# Altium schematic sheet PAGE06 FPGA Power.SchDoc
size 246 x 182 mm; SheetNumber: 6; SheetTotal: 9
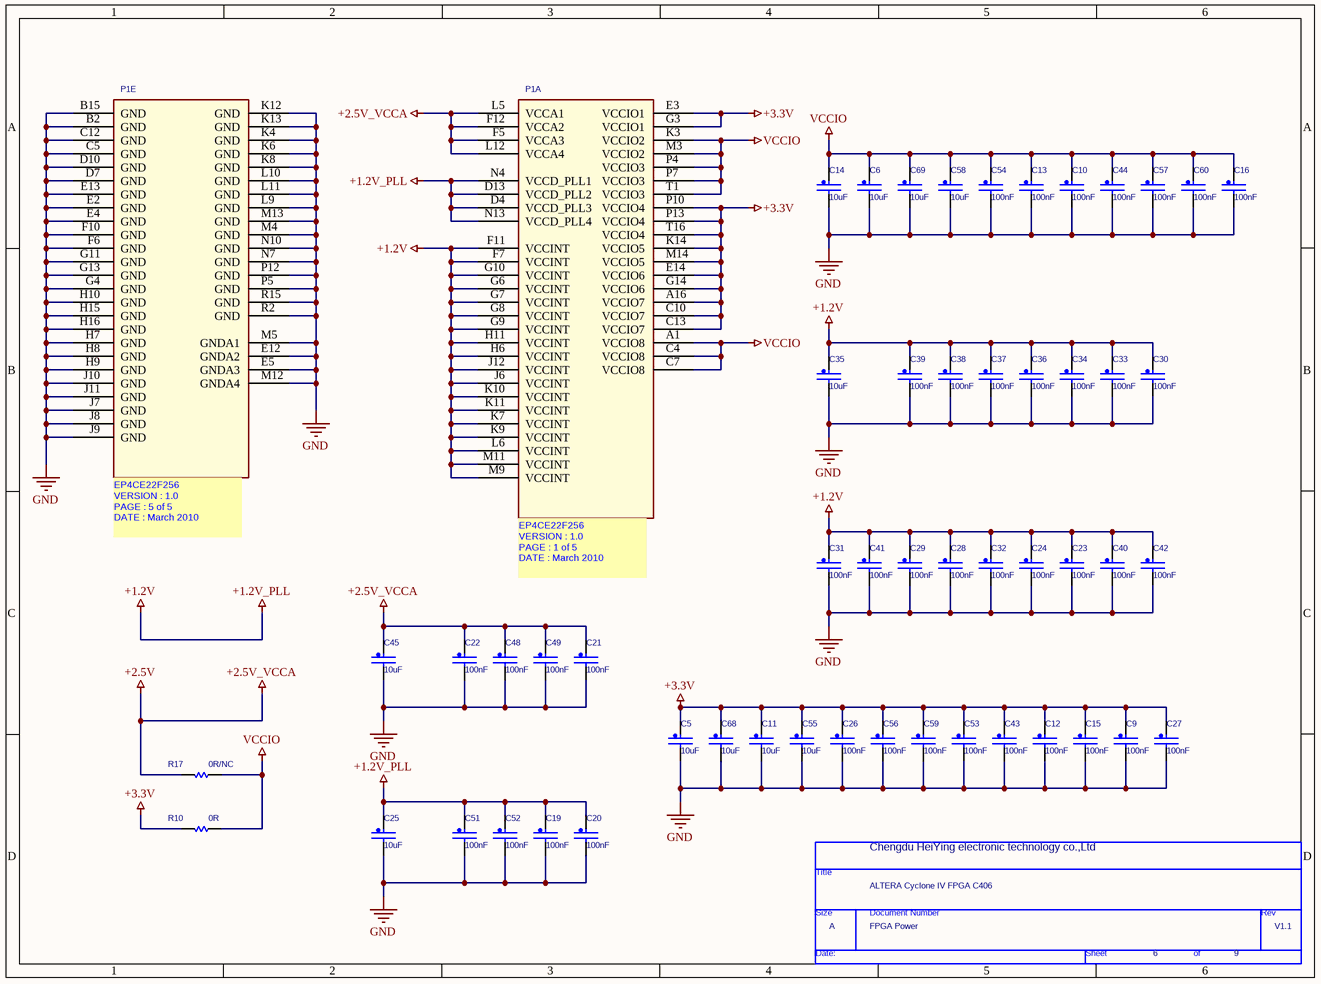
[diagram p0: PAGE06 FPGA Power.SchDoc]

## Parts
*  Page Count: 9  Page Number: 6  Page Size: A  Title: ALTERA Cyclone IV FPGA C406  RevCode: V1.1  Doc: FPGA Power  (hidden comment: TitleBlock0)  (graphical)
C5  10uF  [C0805]
C6  10uF  [C0805]
C9  100nF  [C0402]
C10  100nF  [C0402]
C11  10uF  [C0805]
C12  100nF  [C0402]
C13  100nF  [C0402]
C14  10uF  [C0805]
C15  100nF  [C0402]
C16  100nF  [C0402]
C19  100nF  [C0402]
C20  100nF  [C0402]
C21  100nF  [C0402]
C22  100nF  [C0402]
C23  100nF  [C0402]
C24  100nF  [C0402]
C25  10uF  [C0805]
C26  100nF  [C0402]
C27  100nF  [C0402]
C28  100nF  [C0402]
C29  100nF  [C0402]
C30  100nF  [C0402]
C31  100nF  [C0402]
C32  100nF  [C0402]
C33  100nF  [C0402]
C34  100nF  [C0402]
C35  10uF  [C0805]
C36  100nF  [C0402]
C37  100nF  [C0402]
C38  100nF  [C0402]
C39  100nF  [C0402]
C40  100nF  [C0402]
C41  100nF  [C0402]
C42  100nF  [C0402]
C43  100nF  [C0402]
C44  100nF  [C0402]
C45  10uF  [C0805]
C48  100nF  [C0402]
C49  100nF  [C0402]
C51  100nF  [C0402]
C52  100nF  [C0402]
C53  100nF  [C0402]
C54  100nF  [C0402]
C55  10uF  [C0805]
C56  100nF  [C0402]
C57  100nF  [C0402]
C58  10uF  [C0805]
C59  100nF  [C0402]
C60  100nF  [C0402]
C68  10uF  [C0805]
C69  10uF  [C0805]
P1  EP4CE22F256  [fbga256_opt1]  (value not drawn)  (parts A,E of 5)
R10  0R  [R0402]
R17  0R/NC  [R0402]

## Nets
+1.2V: C19.1 C20.1 C23.1 C24.1 C25.1 C28.1 C29.1 C30.1 C31.1 C32.1 C33.1 C34.1 C35.1 C36.1 C37.1 C38.1 C39.1 C40.1 C41.1 C42.1 C51.1 C52.1 P1.D4(VCCD_PLL3) P1.D13(VCCD_PLL2) P1.F7(VCCINT) P1.F11(VCCINT) P1.G6(VCCINT) P1.G7(VCCINT) P1.G8(VCCINT) P1.G9(VCCINT) P1.G10(VCCINT) P1.H6(VCCINT) P1.H11(VCCINT) P1.J6(VCCINT) P1.J12(VCCINT) P1.K7(VCCINT) P1.K9(VCCINT) P1.K10(VCCINT) P1.K11(VCCINT) P1.L6(VCCINT) P1.M9(VCCINT) P1.M11(VCCINT) P1.N4(VCCD_PLL1) P1.N13(VCCD_PLL4)  [also labelled +1.2V_PLL]
+2.5V: C21.1 C22.1 C45.1 C48.1 C49.1 P1.F5(VCCA3) P1.F12(VCCA2) P1.L5(VCCA1) P1.L12(VCCA4) R17.2  [also labelled +2.5V_VCCA]
+3.3V: C5.1 C9.1 C11.1 C12.1 C15.1 C26.1 C27.1 C43.1 C53.1 C55.1 C56.1 C59.1 C68.1 P1.A16(VCCIO7) P1.C10(VCCIO7) P1.C13(VCCIO7) P1.E3(VCCIO1) P1.E14(VCCIO6) P1.G3(VCCIO1) P1.G14(VCCIO6) P1.K14(VCCIO5) P1.M14(VCCIO5) P1.P10(VCCIO4) P1.P13(VCCIO4) P1.T16(VCCIO4) R10.2
GND: C5.2 C6.2 C9.2 C10.2 C11.2 C12.2 C13.2 C14.2 C15.2 C16.2 C19.2 C20.2 C21.2 C22.2 C23.2 C24.2 C25.2 C26.2 C27.2 C28.2 C29.2 C30.2 C31.2 C32.2 C33.2 C34.2 C35.2 C36.2 C37.2 C38.2 C39.2 C40.2 C41.2 C42.2 C43.2 C44.2 C45.2 C48.2 C49.2 C51.2 C52.2 C53.2 C54.2 C55.2 C56.2 C57.2 C58.2 C59.2 C60.2 C68.2 C69.2 P1.B2(GND) P1.B15(GND) P1.C5(GND) P1.C12(GND) P1.D7(GND) P1.D10(GND) P1.E2(GND) P1.E4(GND) P1.E5(GNDA3) P1.E12(GNDA2) P1.E13(GND) P1.F6(GND) P1.F10(GND) P1.G4(GND) P1.G11(GND) P1.G13(GND) P1.H7(GND) P1.H8(GND) P1.H9(GND) P1.H10(GND) P1.H15(GND) P1.H16(GND) P1.J7(GND) P1.J8(GND) P1.J9(GND) P1.J10(GND) P1.J11(GND) P1.K4(GND) P1.K6(GND) P1.K8(GND) P1.K12(GND) P1.K13(GND) P1.L9(GND) P1.L10(GND) P1.L11(GND) P1.M4(GND) P1.M5(GNDA1) P1.M12(GNDA4) P1.M13(GND) P1.N7(GND) P1.N10(GND) P1.P5(GND) P1.P12(GND) P1.R2(GND) P1.R15(GND)
VCCIO: C6.1 C10.1 C13.1 C14.1 C16.1 C44.1 C54.1 C57.1 C58.1 C60.1 C69.1 P1.A1(VCCIO8) P1.C4(VCCIO8) P1.C7(VCCIO8) P1.K3(VCCIO2) P1.M3(VCCIO2) P1.P4(VCCIO3) P1.P7(VCCIO3) P1.T1(VCCIO3) R10.1 R17.1

## Notes on the sheet
- Chengdu HeiYing electronic technology co.,Ltd
- (in symbol EP4CE22F256, part A) EP4CE22F256 / VERSION : 1.0 / PAGE : 1 of 5 / DATE : March 2010 /
- (in symbol EP4CE22F256, part E) EP4CE22F256 / VERSION : 1.0 / PAGE : 5 of 5 / DATE : March 2010 /
- (in symbol TitleBlock0) Title; Size; Document Number; Rev; Date:; Sheet; of

## Library data of the parts
C5 C11 C14 C25 C58 C69 = CAP_NP: Capacitor, 10u, 0805, X6S, 10%, 10V; AGILE_PN: 150-75429; MFG_NAME01: MURATA; MFG_PN01: GRM31CR71A106KA01L; CAD_APPROVED: Yes; FPLIST: CC0201,CC0201_HD,CC0201_3PIN,0201_CC; Tolerance: 10%; ROHS: Yes; HEIGHT: 0.33MM
C6 C35 C45 C55 C68 = CAP_NP: Capacitor, 10u, 0805, X6S, 10%, 10V; FPLIST: CC0201,CC0201_HD,CC0201_3PIN,0201_CC; CAD_APPROVED: Yes; MFG_PN01: GRM31CR71A106KA01L; MFG_NAME01: MURATA; AGILE_PN: 150-75429; HEIGHT: 0.33MM; ROHS: Yes; Tolerance: 10%
C9 C10 C13 C15 C16 C19 C21 C24 C28 C33 C36 C38 C40 C41 C44 C48 C51 C53 C56 = CAP_NP: CAP CER 0.1UF 6.3V 10% X5R 0201; AGILE_PN: 150-75429; MFG_NAME01: MURATA; MFG_PN01: GRM033R60J104KE19D; CAD_APPROVED: Yes; FPLIST: CC0201,CC0201_HD,CC0201_3PIN,0201_CC; Tolerance: 10%; ROHS: Yes; HEIGHT: 0.33MM
C12 C20 C22 C23 C26 C27 C29-C32 C34 C37 C39 C42 C43 C49 C52 C54 C57 C59 C60 = CAP_NP: CAP CER 0.1UF 6.3V 10% X5R 0201; FPLIST: CC0201,CC0201_HD,CC0201_3PIN,0201_CC; CAD_APPROVED: Yes; MFG_PN01: GRM033R60J104KE19D; MFG_NAME01: MURATA; AGILE_PN: 150-75429; HEIGHT: 0.33MM; ROHS: Yes; Tolerance: 10%
P1 = EP4CE22F256: SWAP_INFO: (S1+S2+S3+S4+S5); SPLIT_INST: TRUE
R10 R17 = SMALL R1
* = TitleBlock0: Page Create Date: March  8, 1995